# EAGLE design scheme (EAGLE 6.4)
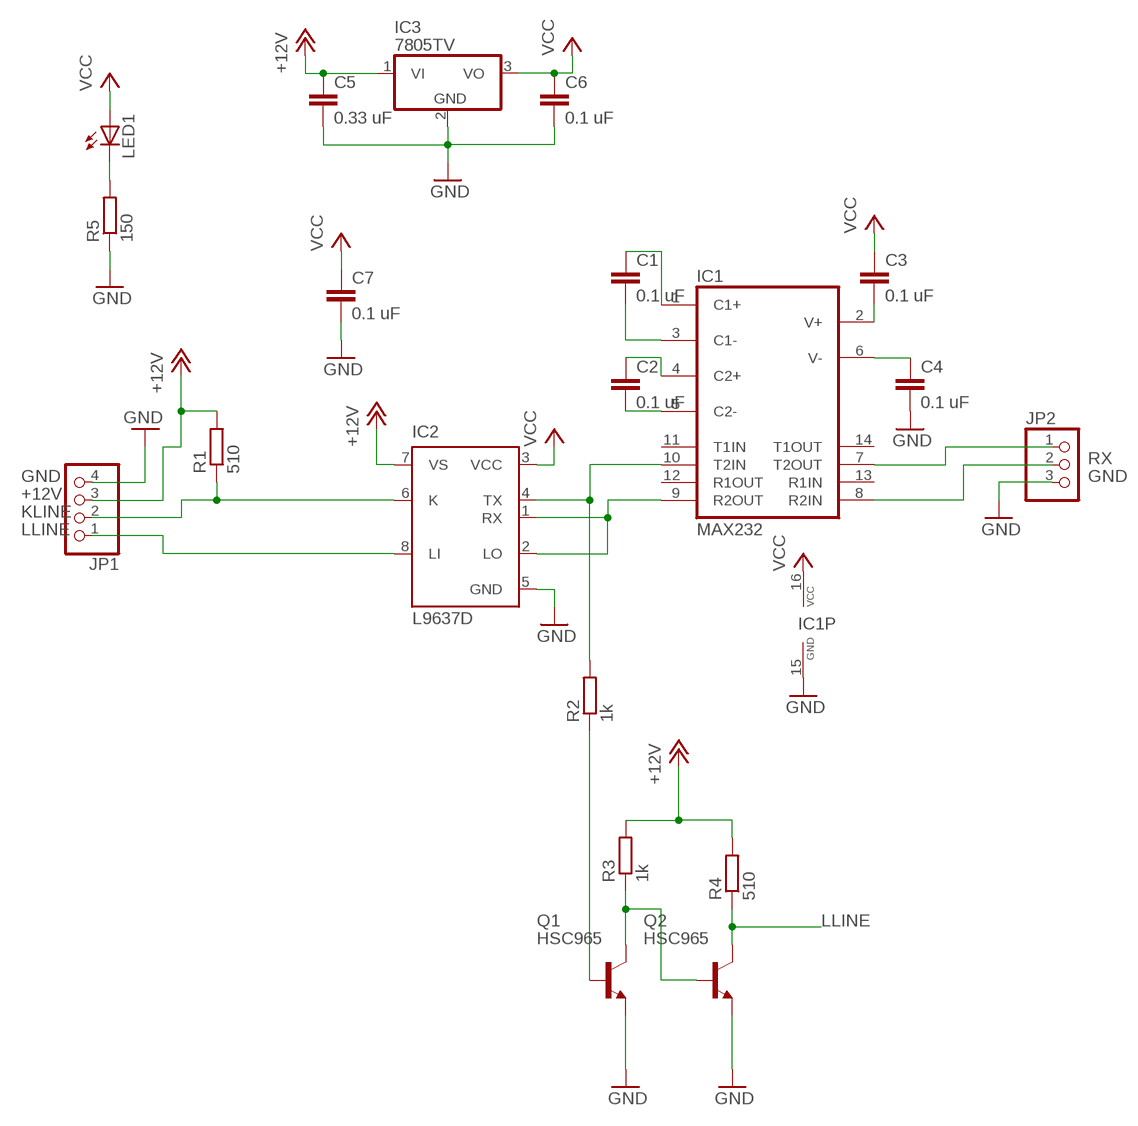
[diagram p0: schematic, sheet 1]

## Parts
C1  0.1 uF  C-EUC0805K  [C0805K]
C2  0.1 uF  C-EUC0805K  [C0805K]
C3  0.1 uF  C-EUC0805K  [C0805K]
C4  0.1 uF  C-EUC0805K  [C0805K]
C5  0.33 uF  C-EUC0805K  [C0805K]
C6  0.1 uF  C-EUC0805K  [C0805K]
C7  0.1 uF  C-EUC0805K  [C0805K]
IC1  MAX232  [DIL16]
IC2  L9637D  [SO08]
IC3  7805TV  [TO220V]
JP1  PINHD-1X4  [1X04]
JP2  PINHD-1X3  [1X03]
LED1  LED3MM  [LED3MM]
Q1  HSC965  [TO92-]
Q2  HSC965  [TO92-]
R1  510  R-EU_R0805  [R0805]
R2  1k  R-EU_R0805  [R0805]
R3  1k  R-EU_R0805  [R0805]
R4  510  R-EU_R0805  [R0805]
R5  150  R-EU_R0805  [R0805]

## Nets
+12V: C5.1 IC2.7(VS) IC3.1(VI) JP1.3 R1.2 R3.2 R4.2
GND: C4.2 C5.2 C6.2 C7.2 IC1.15(GND) IC2.5(GND) IC3.2(GND) JP1.4 JP2.3 Q1.3(E) Q2.3(E) R5.1
KLINE: IC2.6(K) JP1.2 R1.1
LLINE: IC2.8(LI) JP1.1 Q2.2(C) R4.1
N$1: IC1.10(T2IN) IC2.4(TX) R2.2
N$2: IC1.9(R2OUT) IC2.1(RX) IC2.2(LO)
N$3: C2.2 IC1.5(C2-)
N$4: C2.1 IC1.4(C2+)
N$5: C1.2 IC1.3(C1-)
N$6: C1.1 IC1.1(C1+)
N$7: C3.2 IC1.2(V+)
N$8: C4.1 IC1.6(V-)
N$9: IC1.7(T2OUT) JP2.1
N$10: LED1.K(C) R5.2
N$12: Q1.1(B) R2.1
N$16: Q1.2(C) Q2.1(B) R3.1
RX: IC1.8(R2IN) JP2.2
VCC: C3.1 C6.1 C7.1 IC1.16(VCC) IC2.3(VCC) IC3.3(VO) LED1.A
Unconnected: IC1.11(T1IN) IC1.12(R1OUT) IC1.13(R1IN) IC1.14(T1OUT)

## Library data of the parts
C1-C7 = resistor:C-EU: CAPACITOR, European symbol
IC1 = maxim:MAX232: RS232 TRANSEIVER; MF: MAXIM; MPN: MAX232ACPE+; OC_FARNELL: 9723773; OC_NEWARK: 68K4544
IC2 = st-microelectronics:L9637D: ISO 9141 INTERFACE Source: 1765.pdf; MPN: L9637D; OC_FARNELL: unknown; OC_NEWARK: 56P8926
IC3 = linear:78*: Positive VOLTAGE REGULATOR Source: http://cache.national.com/ds/LM/LM78L05.pdf http://www.fairchildsemi.com/ds/LM/LM7805.pdf
JP1 = pinhead:PINHD-1X4: PIN HEADER
JP2 = pinhead:PINHD-1X3: PIN HEADER
LED1 = led:LED: LED OSRAM: - CHIPLED LG R971, LG N971, LY N971, LG Q971, LY Q971, LO R971, LY R971 LH N974, LH R974 LS Q976, LO Q976, LY Q976 LO Q996 - Hyper CHIPLED LW Q18S LB Q993, LB Q99A, LB R99A - SideLED LS A670, LO A670, LY A670, LG A670, LP A670 LB A673, LV A673, LT A673, LW A673 LH A674 LY A675 LS A676, LA A676, LO A676, LY A676, LW A676 LS A679, LY A679, LG A679 - Hyper Micro SIDELED® LS Y876, LA Y876, LO Y876, LY Y876 LT Y87S - SmartLED LW L88C, LW L88S LB L89C, LB L89S, LG L890 LS L89K, LO L89K, LY L89K LS L896, LA L896, LO L896, LY L896 - TOPLED LS T670, LO T670, LY T670, LG T670, LP T670 LSG T670, LSP T670, LSY T670, LOP T670, LYG T670 LG T671, LOG T671, LSG T671 LB T673, LV T673, LT T673, LW T673 LH T674 LS T676, LA T676, LO T676, LY T676, LB T676, LH T676, LSB T676, LW T676 LB T67C, LV T67C, LT T67C, LS T67K, LO T67K, LY T67K, LW E67C LS E67B, LA E67B, LO E67B, LY E67B, LB E67C, LV E67C, LT E67C LW T67C LS T679, LY T679, LG T679 LS T770, LO T770, LY T770, LG T770, LP T770 LB T773, LV T773, LT T773, LW T773 LH T774 LS E675, LA E675, LY E675, LS T675 LS T776, LA T776, LO T776, LY T776, LB T776 LHGB T686 LT T68C, LB T68C - Hyper Mini TOPLED® LB M676 - Mini TOPLED Santana® LG M470 LS M47K, LO M47K, LY M47K Source: http://www.osram.convergy.de LUXEON: - LUMILED® LXK2-PW12-R00, LXK2-PW12-S00, LXK2-PW14-U00, LXK2-PW14-V00 LXK2-PM12-R00, LXK2-PM12-S00, LXK2-PM14-U00 LXK2-PE12-Q00, LXK2-PE12-R00, LXK2-PE12-S00, LXK2-PE14-T00, LXK2-PE14-U00 LXK2-PB12-K00, LXK2-PB12-L00, LXK2-PB12-M00, LXK2-PB14-N00, LXK2-PB14-P00, LXK2-PB14-Q00 LXK2-PR12-L00, LXK2-PR12-M00, LXK2-PR14-Q00, LXK2-PR14-R00 LXK2-PD12-Q00, LXK2-PD12-R00, LXK2-PD12-S00 LXK2-PH12-R00, LXK2-PH12-S00 LXK2-PL12-P00, LXK2-PL12-Q00, LXK2-PL12-R00 Source: www.luxeon.com KINGBRIGHT: KA-3528ASYC Source: www.kingbright.com
Q1 Q2 = mylib:HSC965
R1-R5 = resistor:R-EU_: RESISTOR, European symbol

## Board
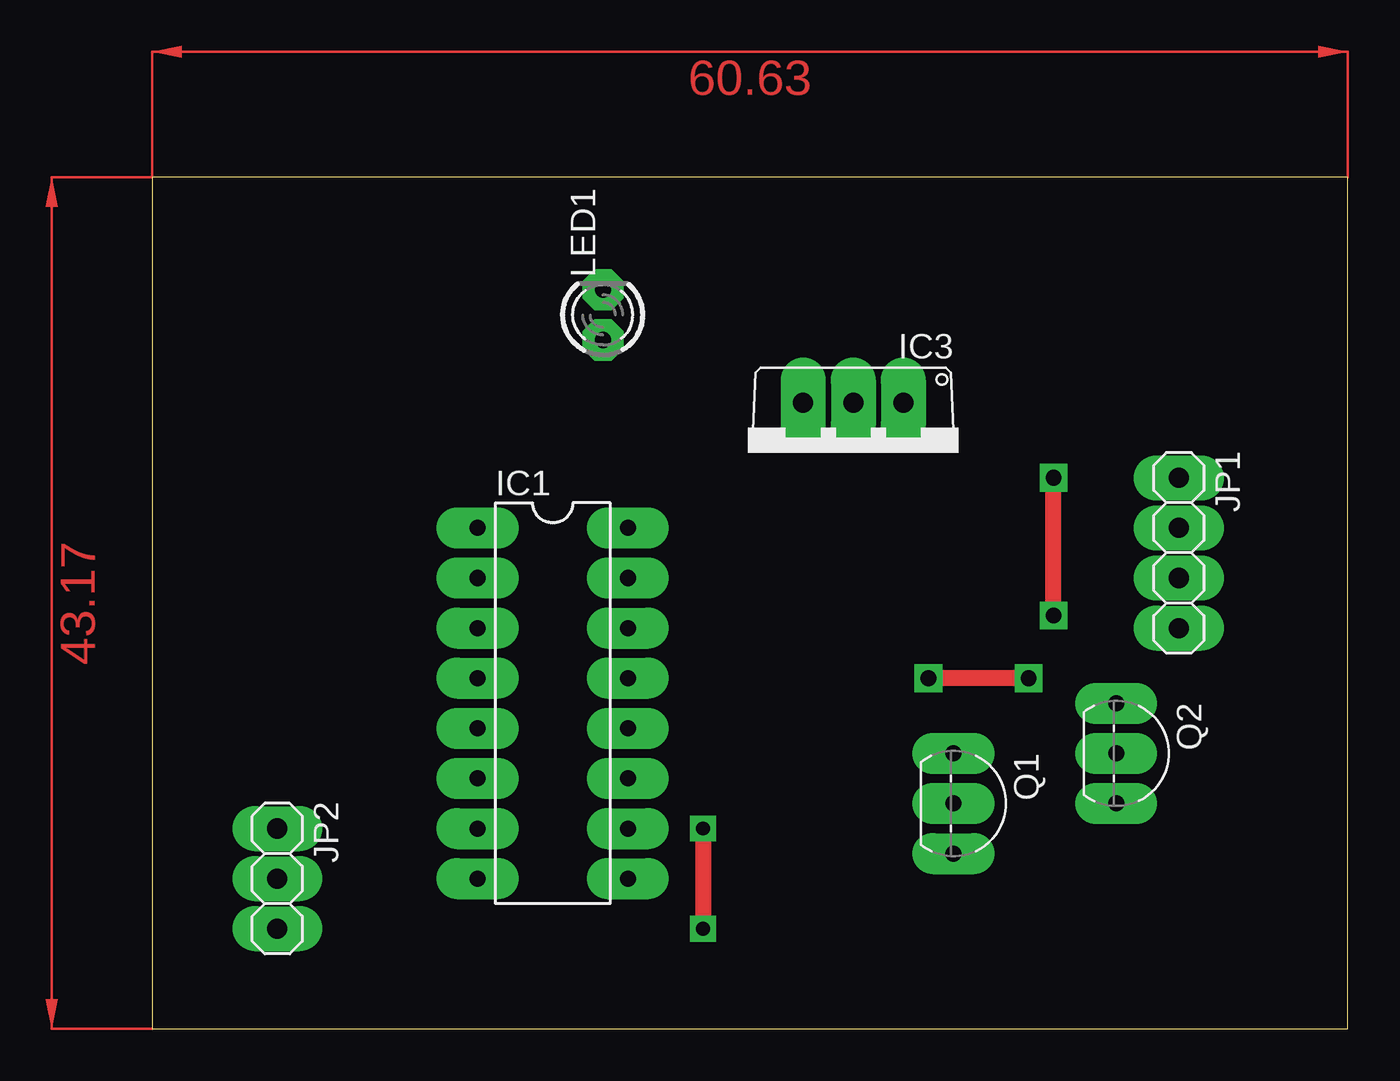
[diagram p1: board, top side]
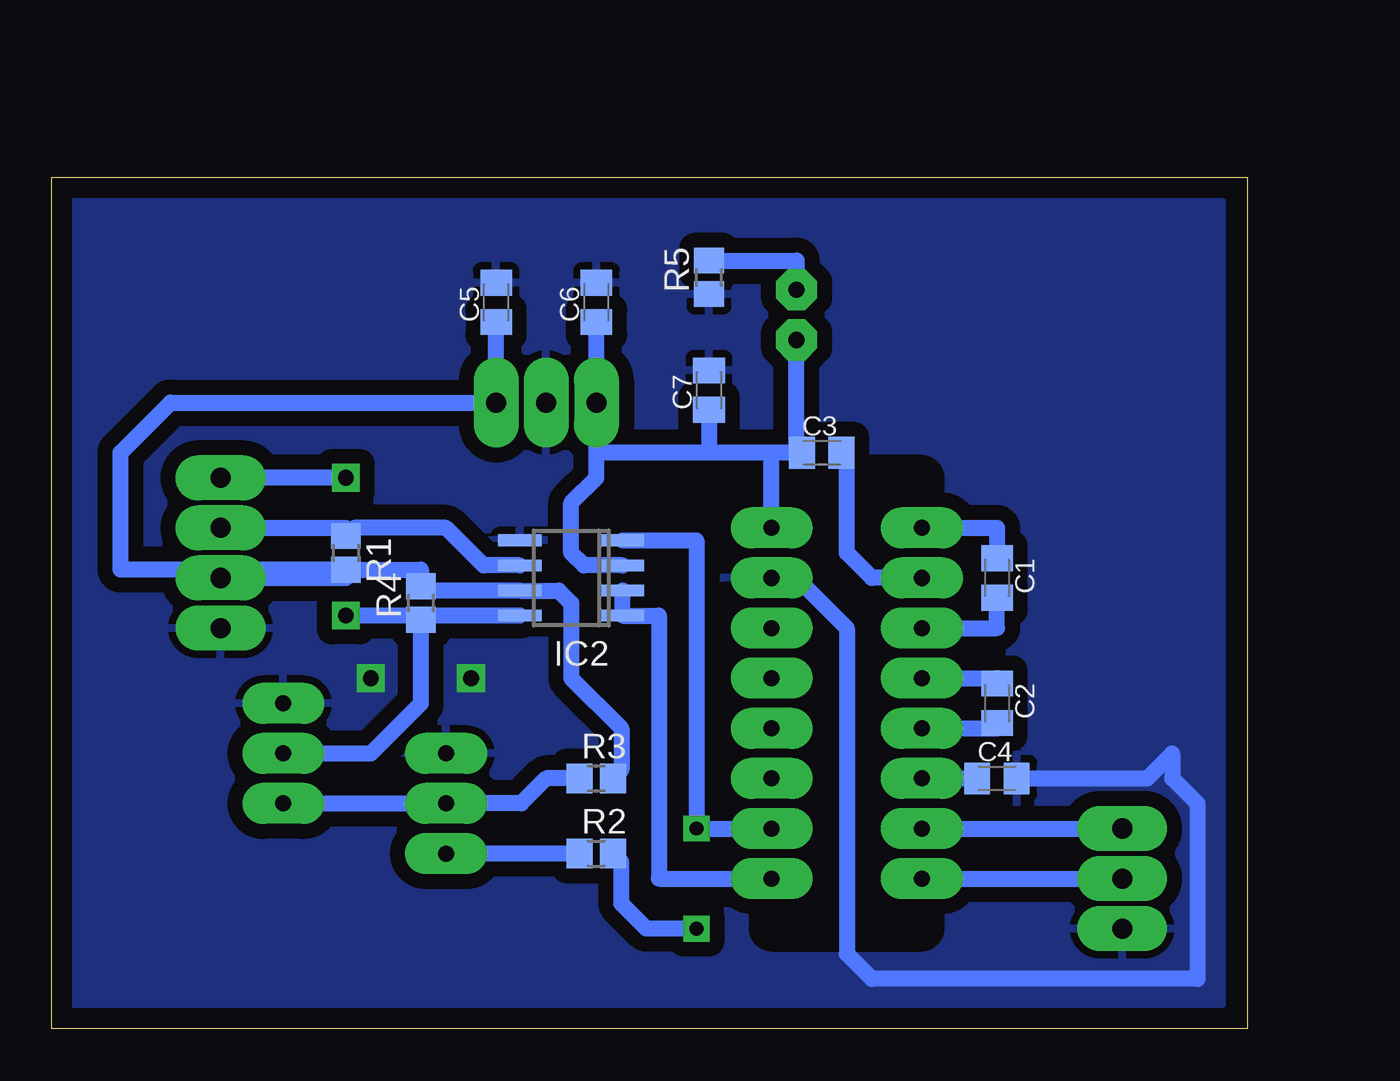
[diagram p2: board, bottom side, seen from below]

Size 60.63 x 43.17 mm. Coordinates in mm from the lower left corner, seen from the top.
Outline: 0,0 60.63,0 60.63,43.17 0,43.17 0,0
Copper layers (1*16): Top 0.035mm / dielectric 1.5mm / Bottom 0.035mm
Design rules "default": minimum track width 10mil, minimum drill 32mil, track to track 12mil, track to pad 12mil, pad to pad 12mil, via to via 12mil, smd to smd 8mil, copper to edge 40mil, drill to drill 40mil, minimum pad ring 25mil, minimum via ring 12mil, stop-mask expansion 4mil, vias tented up to drill 0mil, thermal gap 15mil
bRestrict: area 16.5,5.1 to 24.1,27.9

### Footprints (pad centres in the part's own frame; a part is rotated, then mirrored left to right if it is on the bottom)
C0805K = smd 1.3 x 1.6: 1 -1,0; 2 1,0
DIL16 = drill 0.813 long: 1 -8.89,-3.81; 2 -6.35,-3.81; 3 -3.81,-3.81; 4 -1.27,-3.81; 5 1.27,-3.81; 6 3.81,-3.81; 7 6.35,-3.81; 8 8.89,-3.81; 9 8.89,3.81; 10 6.35,3.81; 11 3.81,3.81; 12 1.27,3.81; 13 -1.27,3.81; 14 -3.81,3.81; 15 -6.35,3.81; 16 -8.89,3.81
SO08 = smd 0.6 x 2.2: 1 -1.905,-2.6; 2 -0.635,-2.6; 3 0.635,-2.6; 4 1.905,-2.6; 5 1.905,2.6; 6 0.635,2.6; 7 -0.635,2.6; 8 -1.905,2.6
TO220V = drill 1.016 long: 1 -2.54,-2.54; 2 0,-2.54; 3 2.54,-2.54
1X04 = drill 1.016 long: 1 -3.81,0; 2 -1.27,0; 3 1.27,0; 4 3.81,0
1X03 = drill 1.016 long: 1 -2.54,0; 2 0,0; 3 2.54,0
LED3MM = drill 0.813 octagon: A -1.27,0; K 1.27,0
TO92- = drill 0.813 long: 1 2.54,0; 2 0,0; 3 -2.54,0
R0805 = smd 1.3 x 1.5: 1 -0.85,0; 2 0.85,0

### Placement (x,y rotation side)
C1  12.7,22.86 270 bottom
C2  12.7,16.51 270 bottom
C3  21.59,29.21 0 bottom
C4  12.7,12.7 0 bottom
C5  38.1,36.83 90 bottom
C6  33.02,36.83 90 bottom
C7  27.3,32.38 90 bottom
IC1  20.32,16.51 270 top
IC2  34.29,22.86 90 bottom
IC3  35.56,29.21 180 top
JP1  52.07,24.13 270 top
JP2  6.35,7.62 270 top
LED1  22.86,36.2 90 top
Q1  40.64,11.43 270 top
Q2  48.9,13.97 270 top
R1  45.72,24.13 270 bottom
R2  33.02,8.89 0 bottom
R3  33.02,12.7 0 bottom
R4  41.91,21.59 90 bottom
R5  27.3,38.1 90 bottom

### Tracks (layer width: path | path; a pad name or v marks a point on that pad's centre or on a via)
+12V
  Bottom 0.813: C5.1 IC3.1 54.61,31.75 57.15,29.21 57.15,23.28 R1.2 | R3.2 31.75,13.12 31.75,15.24 34.29,17.78 34.29,21.59 34.92,22.23 IC2.7 41.91,22.23 R4.2 41.91,23.28 R1.2 | JP1.3 45.72,22.86 R1.2
GND  (via drill 0.8)
  Top 0.813: v44.45,17.78 v39.37,17.78
  Bottom 0.813: IC1.15 22.86,22.86 20.32,20.32 20.32,3.81 19.05,2.54 2.54,2.54 2.54,11.43 3.81,12.7 3.81,13.97 5.08,12.7 C4.2
  pour Bottom (isolate 0.762): 1.27,41.91 59.69,41.91 59.69,1.27 1.27,1.27
KLINE
  Bottom 0.813: IC2.6 38.73,23.5 40.64,25.4 45.3,25.4 R1.1 45.72,25.4 JP1.2
LLINE  (via drill 0.8)
  Top 0.813: v45.72,20.95 v45.72,27.94
  Bottom 0.813: Q2.2 44.45,13.97 41.91,16.51 R4.1 41.91,20.95 | IC2.8 41.91,20.95 | 41.91,20.95 v45.72,20.95 | v45.72,27.94 JP1.1
N$1  (via drill 0.7)
  Top 0.813: v27.94,10.16 v27.94,5.08
  Bottom 0.813: IC2.4 27.94,24.77 v27.94,10.16 IC1.10 | v27.94,5.08 30.48,5.08 31.75,6.35 31.75,8.47 R2.2
N$2
  Bottom 0.813: IC1.9 29.84,7.62 29.84,20.95 IC2.1 IC2.2
N$3
  Bottom 0.813: IC1.5 12.7,15.24 C2.2
N$4
  Bottom 0.813: IC1.4 12.7,17.78 C2.1
N$5
  Bottom 0.813: IC1.3 12.7,20.32 C1.2
N$6
  Bottom 0.813: IC1.1 12.7,25.4 C1.1
N$7
  Bottom 0.813: IC1.2 19.05,22.86 20.32,24.13 20.32,28.94 C3.2
N$8
  Bottom 0.813: IC1.6 C4.1
N$9
  Bottom 0.813: IC1.7 JP2.1
N$10
  Bottom 0.813: R5.2 22.86,38.95 LED1.K
N$12
  Bottom 0.813: R2.1 Q1.1
N$16
  Bottom 0.813: R3.1 35.56,12.7 36.83,11.43 Q1.2 Q2.1
RX
  Bottom 0.813: IC1.8 JP2.2
VCC
  Bottom 0.813: 33.02,29.21 33.02,27.94 34.29,26.67 34.29,24.13 33.66,23.5 IC2.3 | 33.02,29.21 IC3.3 C6.1 | 24.13,29.21 C3.1 22.86,29.21 LED1.A | IC1.16 24.13,29.21 | 24.13,29.21 27.3,29.21 | 27.3,29.21 33.02,29.21 | C7.1 27.3,29.21
(copper drawn outside any net)
  shapes: Top area x2